# Altium schematic sheet Collective_FAULT_logic.SchDoc
size A4; CompanyName: Technische Hochschule Nürnberg Georg Simon Ohm; Organization: UltraZohm; Address1: Kesslerplatz 12; Address2: 90489 Nürnberg; Address3: GERMANY; SheetNumber: 10; SheetTotal: 36; Website: www.ultrazohm.com
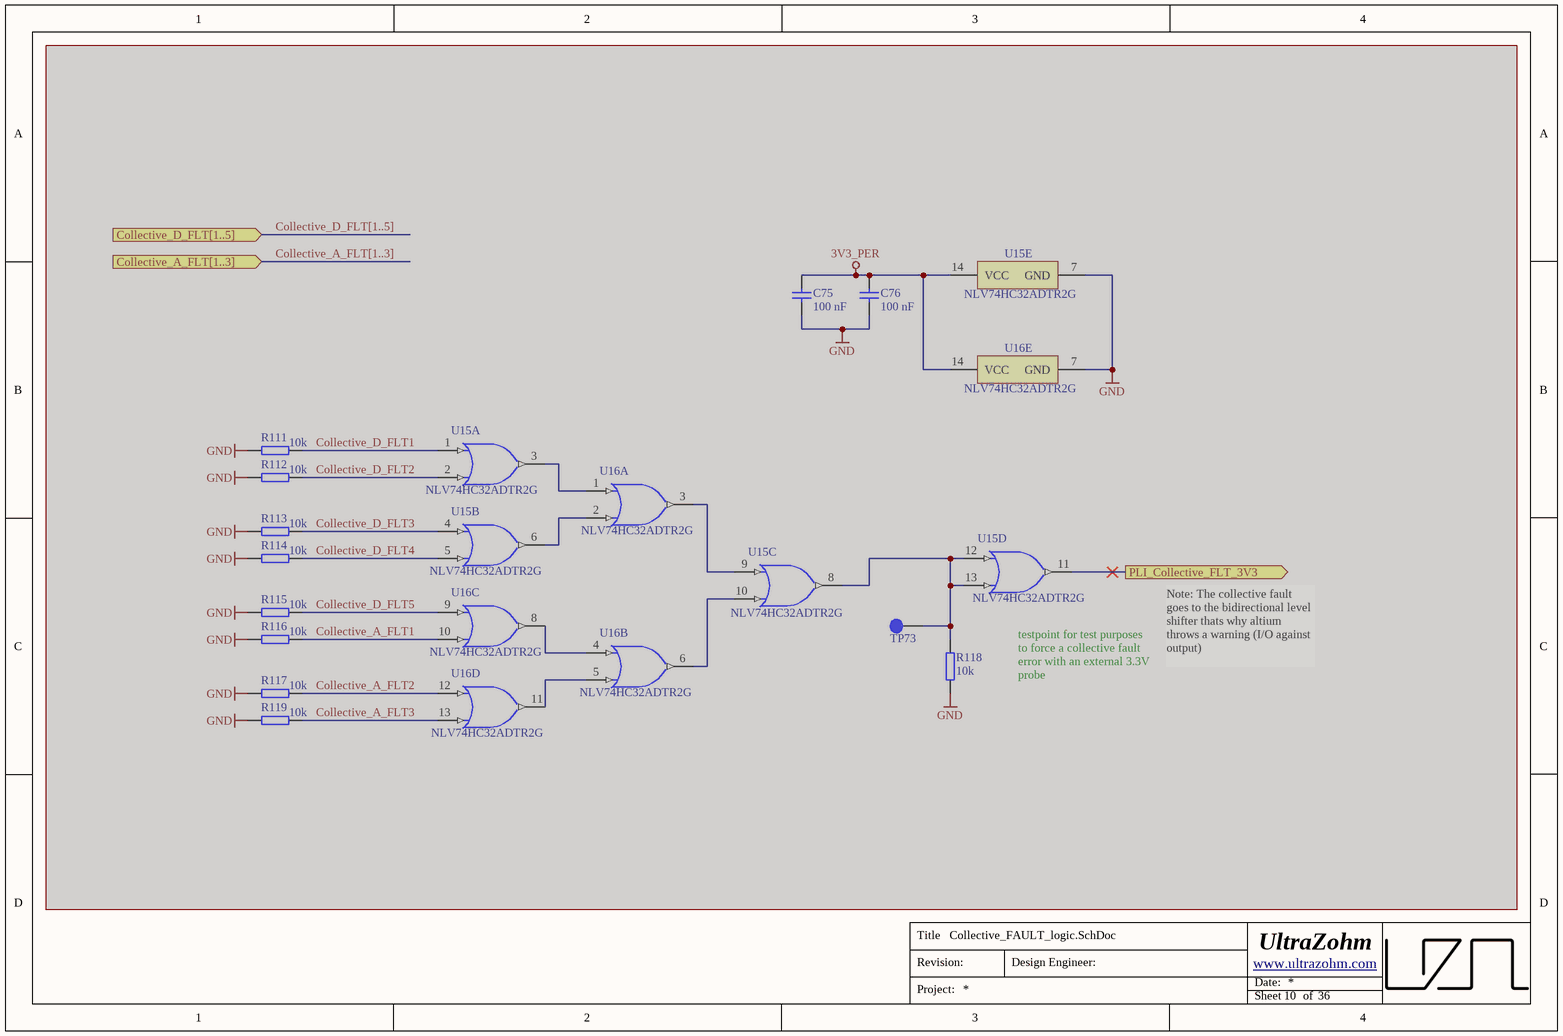
[diagram p0: Collective_FAULT_logic.SchDoc]

## Parts
C75  100 nF  [C_0603_TE]  (masked out: inside a compile mask, not in the netlist)
C76  100 nF  [C_0603_TE]  (masked out: inside a compile mask, not in the netlist)
R111  10k  [R_0603_TE]  (masked out: inside a compile mask, not in the netlist)
R112  10k  [R_0603_TE]  (masked out: inside a compile mask, not in the netlist)
R113  10k  [R_0603_TE]  (masked out: inside a compile mask, not in the netlist)
R114  10k  [R_0603_TE]  (masked out: inside a compile mask, not in the netlist)
R115  10k  [R_0603_TE]  (masked out: inside a compile mask, not in the netlist)
R116  10k  [R_0603_TE]  (masked out: inside a compile mask, not in the netlist)
R117  10k  [R_0603_TE]  (masked out: inside a compile mask, not in the netlist)
R118  10k  [R_0603_TE]  (masked out: inside a compile mask, not in the netlist)
R119  10k  [R_0603_TE]  (masked out: inside a compile mask, not in the netlist)
TP73  Testpoint 1mm  [TP_1mm]  (value not drawn)  (no BOM)  (masked out: inside a compile mask, not in the netlist)
U15  NLV74HC32ADTR2G  [SOP65P640X120-14N]  (parts A,B,C,D,E of 5)  (masked out: inside a compile mask, not in the netlist)
U16  NLV74HC32ADTR2G  [SOP65P640X120-14N]  (parts A,B,C,D,E of 5)  (masked out: inside a compile mask, not in the netlist)

## Ports
Collective_A_FLT[1..3] (in), Collective_D_FLT[1..5] (in), PLI_Collective_FLT_3V3 (out)

## Notes on the sheet
- (near U15) testpoint for test purposes to force a collective fault error with an external 3.3V probe
- Note: The collective fault goes to the bidirectional level shifter thats why altium throws a warning (I/O against output)
- Title
- Revision:
- Design Engineer:
- Date:
- Project:
- Sheet
- of

## Library data of the parts
C75 C76 = UZgen_C_0603_100nF_50V_X7R: Generic capacitor; Manufacturer: UZgen; Tolerance: 10 %; Voltage: 50 V; Created from: AGeiger; Value: 100 nF; Technology: X7R; Manufacturer Part Number: UZgen_C_0603_100nF_50V_X7R; PartID: 1; Created On: 02/07/2024 14:42:23; Device Package: 0603; Mounting Type: SMD; Last Updated: 02/08/2024 14:45:57
R111-R119 = UZgen_R_0603_10k: Generic resistor; Manufacturer: UZgen; Tolerance: 1 %; Created from: AGeiger; Value: 10k; Manufacturer Part Number: UZgen_R_0603_10k; PartID: 1; Created On: 02.07.2024 14:34:53; Device Package: 0603; Mounting Type: SMD; Last Updated: 02.07.2024 14:37:16
TP73 = 25063: AN: 25063; Mixed: SMT
U15 U16 = 30783: AN: 30783; Mixed: SMT; Trenz-Stock: Yes; Temperature-Range: -55/+125; Extra: Quad 2-Input Positive-Or Gate; Case: TSSOP14; HelpURL: b:\AD\adlib\datasheet\ON_Semiconductor\MC74HC32A\; H-ART: NLV74HC32ADTR2G; Storage-Temperature: -65/+150 (Abs)